# EAGLE schematic VJ1.0v (EAGLE 7.5.0)
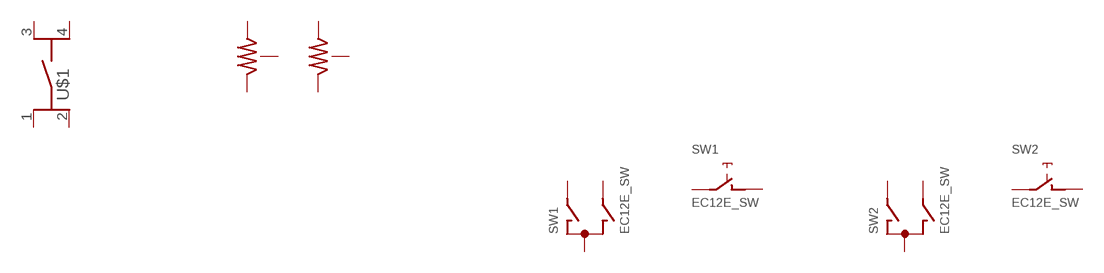
[diagram p0: schematic, sheet 1]

## Parts
SW1  EC12E_SW  [ALPS_EC12E_SW]
SW2  EC12E_SW  [ALPS_EC12E_SW]
U$1  SKRPACE010  [SKRP]
U$2  RS_ADJ  [RS4511119]
U$3  RS_ADJ  [RS4511119]
Unconnected: SW1.A SW1.B SW1.C SW1.D SW1.E SW1.GND1(G) SW1.GND2(G) SW2.A SW2.B SW2.C SW2.D SW2.E SW2.GND1(G) SW2.GND2(G) U$1.1 U$1.2(1_) U$1.3 U$1.4(2_) U$2.1(UE) U$2.2(NAKA) U$2.3(SITA) U$3.1(UE) U$3.2(NAKA) U$3.3(SITA)

## Library data of the parts
SW1 SW2 = switch-alps:EC12E_SW: ALPS rotary Encoder EC12E series with switch
U$1 = 09_1_switch:SKRPACE010
U$2 U$3 = 01_R:RS_ADJ